# Altium schematic sheet ProtectionChannelC.SchDoc
size 420 x 297 mm; Address1: Address1; Address2: Address2; Address3: Address3; Address4: Address4; DocumentNumber: АБВГ.123456.001 Э3; SheetNumber: 4; SheetTotal: 7; Scale: 1:1; DocumentType: Схема электрическая принципиальная; FirstReferrence: АБВГ.123456.001
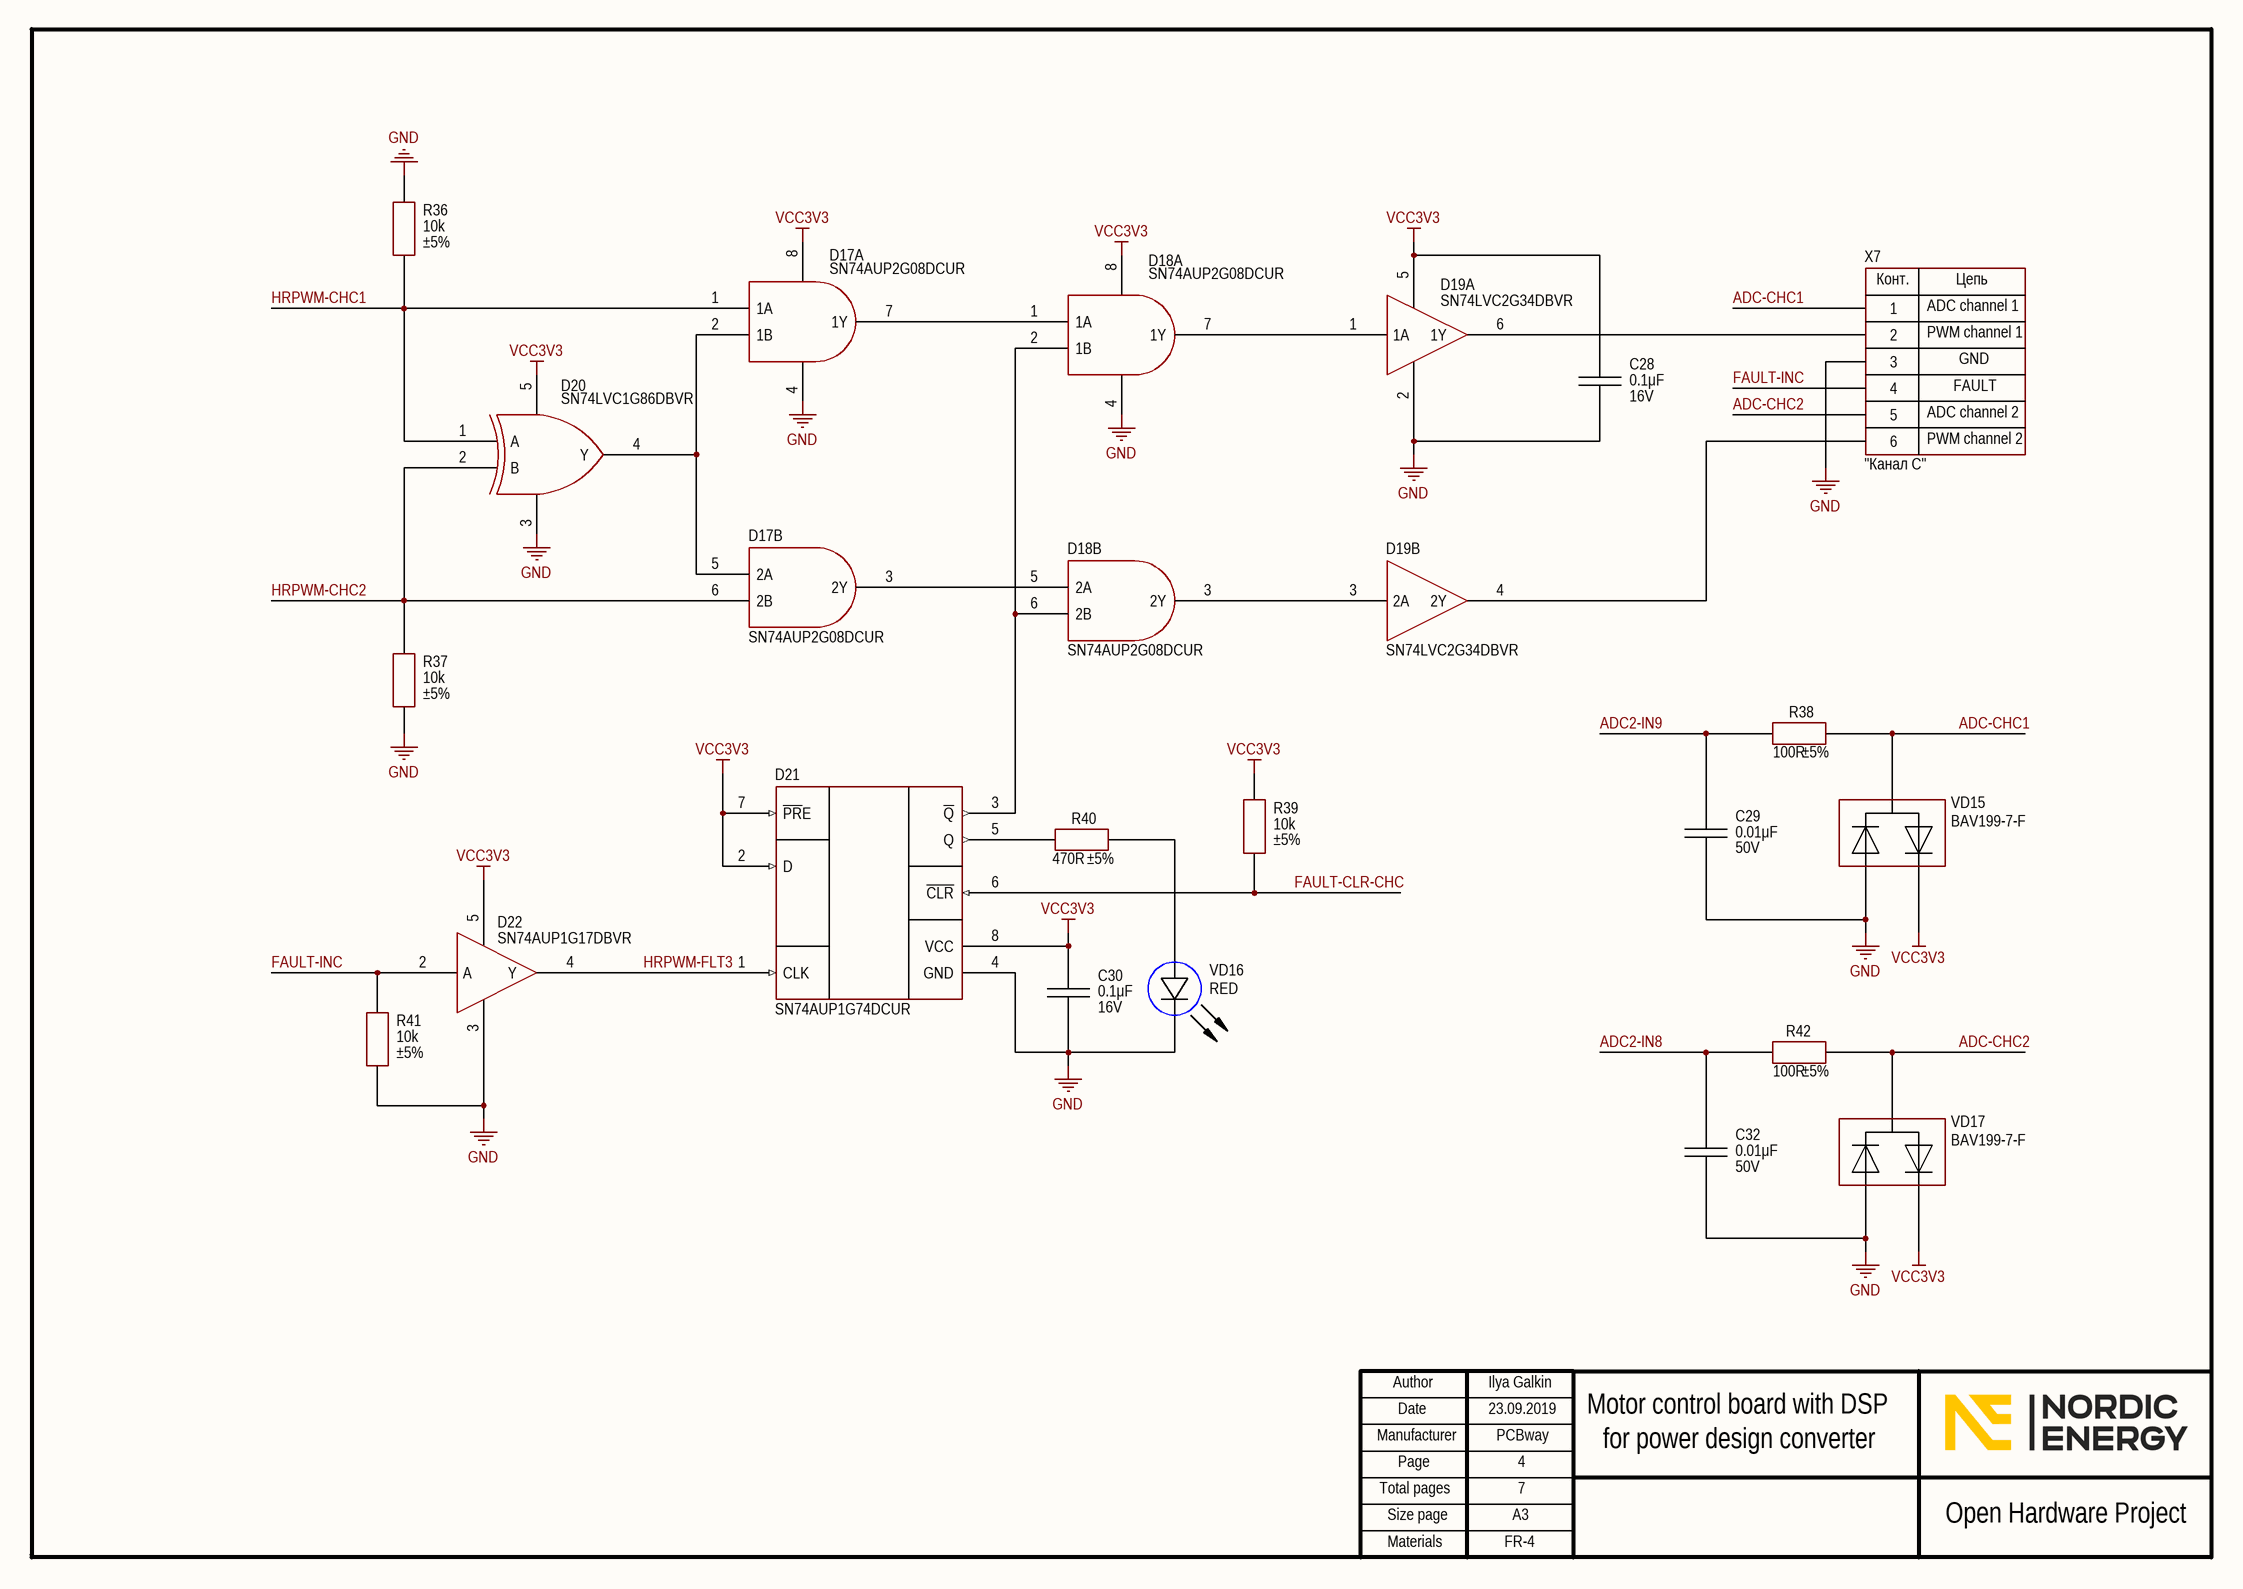
[diagram p0: ProtectionChannelC.SchDoc]

## Parts
C28  value 0.1μF  Voltage: 16V  [CAP: 0805]
C29  value 0.01μF  Voltage: 50V  [CAP: 0805]
C30  value 0.1μF  Voltage: 16V  [CAP: 0805]
C32  value 0.01μF  Voltage: 50V  [CAP: 0805]
D17  (no value)  [8-VSSOP]  (parts A,B of 2)
D18  (no value)  [8-VSSOP]  (parts A,B of 2)
D19  (no value)  [SOT23-6]  (parts A,B of 2)
D20  (no value)  [SOT23-5]
D21  (no value)  [8-VSSOP]
D22  (no value)  [SOT23-5]
R36  value 10k  Tolerance: ±5%  [RES: 0805]
R37  value 10k  Tolerance: ±5%  [RES: 0805]
R38  value 100R  Tolerance: ±5%  [RES: 0805]
R39  value 10k  Tolerance: ±5%  [RES: 0805]
R40  value 470R  Tolerance: ±5%  [RES: 0805]
R41  value 10k  Tolerance: ±5%  [RES: 0805]
R42  value 100R  Tolerance: ±5%  [RES: 0805]
VD15  PartNumber: BAV199-7-F  [SOT23]
VD16  Color: RED  [LED: 0805R]
VD17  PartNumber: BAV199-7-F  [SOT23]
X7  CommentText: "Канал C"  [CON: PLD-6]

## Nets
GND: C28.1 C29.1 C30.1 C32.1 D17.4 D18.4 D19.2 D20.3 D21.4(GND) D22.3 R36.1 R37.2 R41.2 VD15.1 VD16.2(C) VD17.1 X7.3
VCC3V3: C28.2 C30.2 D17.8 D18.8 D19.5 D20.5 D21.2(D) D21.7(~{PR}E) D21.8(VCC) D22.5 R39.1 VD15.2 VD17.2
ADC2-IN8: C32.2 R42.1
ADC2-IN9: C29.2 R38.1
ADC-CHC1: R38.2 VD15.3 X7.1
ADC-CHC2: R42.2 VD17.3 X7.5
FAULT-CLR-CHC: D21.6(~{CLR}) R39.2
FAULT-INC: D22.2(A) R41.1 X7.4
HRPWM-CHC1: D17.1(1A) D20.1(A) R36.2
HRPWM-CHC2: D17.6(2B) D20.2(B) R37.1
HRPWM-FLT3: D21.1(CLK) D22.4(Y)
NetD17_2: D17.2(1B) D17.5(2A) D20.4(Y)
NetD17_3: D17.3(2Y) D18.5(2A)
NetD17_7: D17.7(1Y) D18.1(1A)
NetD18_2: D18.2(1B) D18.6(2B) D21.3(~{Q})
NetD18_3: D18.3(2Y) D19.3(2A)
NetD18_7: D18.7(1Y) D19.1(1A)
NetD19_4: D19.4(2Y) X7.6
NetD19_6: D19.6(1Y) X7.2
NetD21_5: D21.5(Q) R40.2
NetR40_1: R40.1 VD16.1(A)

## Notes on the sheet
- ADC channel 1
- PWM channel 1
- FAULT
- GND
- ADC channel 2
- PWM channel 2
- Ilya Galkin
- 23.09.2019
- PCBway
- 4
- Motor control board with DSP
- for power design converter
- 7
- FR-4
- Author
- Manufacturer
- Date
- Page
- Total pages
- Size page
- A3
- Open Hardware Project
- Materials
- (in symbol PLD-6) Конт.; Цепь

## Library data of the parts
C28 C30 = Ceramic_0805: Manufacturer: Yageo; PartNumber: CC0805KRX7R7BB104; ValueManufacturerPartNumber: Ceramic capacitor, 0.1μF, X7R, ±10%, 16V, 0805, -55...+125°C; TypeCapacitor: Ceramic capacitor; Tolerance: ±10%; TypeDielectric: X7R; Package: 0805; HelpURL: https://www.digikey.com/product-detail/en/yageo/CC0805KRX7R7BB104/311-1142-1-ND/303052; Temperature: -55...+125°C
C29 C32 = Ceramic_0805: Manufacturer: Yageo; PartNumber: CC0805KRX7R9BB103; ValueManufacturerPartNumber: Ceramic capacitor, 0.01μF, X7R, ±10%, 50V, 0805, -55...+125°C; TypeCapacitor: Ceramic capacitor; Tolerance: ±10%; TypeDielectric: X7R; Package: 0805; HelpURL: https://www.digikey.com/product-detail/en/yageo/CC0805KRX7R9BB103/311-1136-1-ND/303046; Temperature: -55...+125°C
D17 D18 = SN74AUP2G08DCUR: AND; Manufacturer: Texas Instruments; ValueManufacturerPartNumber: IC logic AND, 0.8...3.6V, -40...+855°C, 8-VSSOP; Supply: 0.8...3.6V; HelpURL: https://www.digikey.com/product-detail/en/texas-instruments/SN74AUP2G08DCUR/296-32271-1-ND/3505517; Package: 8-VSSOP; ComponentType: IC logic AND; Temperature: -40...+855°C; PartNumber: SN74AUP2G08DCUR
D19 = SN74LVC2G34DBVR: Buffer; Manufacturer: Texas Instruments; ValueManufacturerPartNumber: IC logic buffer, 1.65...5.5V, -40...+125°C, SOT23-6; Supply: 1.65...5.5V; HelpURL: https://www.digikey.com/product-detail/en/texas-instruments/SN74LVC2G34DBVR/296-13496-1-ND/486431; Package: SOT23-6; ComponentType: IC logic buffer; Temperature: -40...+125°C; PartNumber: SN74LVC2G34DBVR
D20 = SN74LVC1G86DBVR: XOR; Manufacturer: Texas Instruments; ValueManufacturerPartNumber: IC logic XOR, 1.65...5.5V, -40...+125°C, SOT23-5; Supply: 1.65...5.5V; HelpURL: https://www.digikey.com/product-detail/en/texas-instruments/SN74LVC1G86DBVR/296-9853-1-ND/380077; Package: SOT23-5; ComponentType: IC logic XOR; Temperature: -40...+125°C; PartNumber: SN74LVC1G86DBVR
D21 = SN74AUP1G74DCUR: D-trigger; Manufacturer: Texas Instruments; ValueManufacturerPartNumber: ICtrigger D-type, 0.8...3.6V, -40...+85°C, 8-VSSOP; Supply: 0.8...3.6V; HelpURL: https://www.digikey.com/product-detail/en/texas-instruments/SN74AUP1G74DCUR/296-19761-1-ND/1091423; Package: 8-VSSOP; ComponentType: ICtrigger D-type; Temperature: -40...+85°C; PartNumber: SN74AUP1G74DCUR
D22 = SN74AUP1G17DBVR: Schmitt trigger; Manufacturer: Texas Instruments; ValueManufacturerPartNumber: IC Schmitt trigger, 0.8...3.6V, -40...+85°C, SOT23-6; Supply: 0.8...3.6V; HelpURL: https://www.digikey.com/product-detail/en/texas-instruments/SN74AUP1G17DBVR/296-19077-1-ND/864308; Package: SOT23-6; ComponentType: IC Schmitt trigger; Temperature: -40...+85°C; PartNumber: SN74AUP1G17DBVR
R36 R37 R39 R41 = Resistor_0805: Manufacturer: Yageo; PartNumber: RC0805JR-0710KL; ValueManufacturerPartNumber: Resistor film, 10k, ±5%, 0805, 0.125W, -55...+125°C; TypeResistor: Resistor film; Power: 0.125W; Package: 0805; HelpURL: https://www.digikey.com/product-detail/en/yageo/RC0805JR-0710KL/311-10KARCT-ND/731188; Temperature: -55...+125°C
R38 R42 = Resistor_0805: Manufacturer: Yageo; PartNumber: RC0805JR-07100RL; ValueManufacturerPartNumber: Resistor film, 100R, ±5%, 0805, 0.125W, -55...+125°C; TypeResistor: Resistor film; Power: 0.125W; Package: 0805; HelpURL: https://www.digikey.com/product-detail/en/yageo/RC0805JR-07100RL/311-100ARCT-ND/731185; Temperature: -55...+125°C
R40 = Resistor_0805: Manufacturer: Yageo; PartNumber: RC0805JR-07470RL; ValueManufacturerPartNumber: Resistor film, 470R, ±5%, 0805, 0.125W, -55...+125°C; TypeResistor: Resistor film; Power: 0.125W; Package: 0805; HelpURL: https://www.digikey.com/product-detail/en/yageo/RC0805JR-07470RL/311-470ARCT-ND/731280; Temperature: -55...+125°C
VD15 VD17 = Diode_array: Manufacturer: Diodes Incorporated; ValueManufacturerPartNumber: Diode array, 85V, 140mA, 1.1V, 3us, SOT-23, -65...+150°C; TypeDiode: Diode array; Voltage: 85V; Current: 140mA; VoltageDrop: 1.1V; RecoveryTime: 3us; Package: SOT-23; HelpURL: https://www.digikey.com/product-detail/en/diodes-incorporated/BAV199-7-F/BAV199-FDICT-ND/1033647; Temperature: -65...+150°C
VD16 = LED_single: Manufacturer: Wurth; ValueManufacturerPartNumber: LED, 20mA, 2V, 0805, -55...+150°C; PartNumber: 150080RS75000; TypeDiode: LED; Current: 20mA; VoltageDrop: 2V; Package: 0805; HelpURL: https://www.digikey.com/product-detail/en/wurth-electronics-inc/150080RS75000/732-4984-1-ND/4489916; Temperature: -55...+150°C
X7 = PLD-6: Manufacturer: Connfly; ValueManufacturerPartNumber: Connector, 6pin, 2.54mm, 500VAC, 3A; TypeConnector: Connector; VoltageMax: 500VAC; Pitch: 2.54mm; CurrentMax: 3A; Multichannel: 6pin; HelpURL: https://www.chipdip.ru/product/pld-6; PartNumber: PLD-6